# EAGLE design pcb_mlx90614 (EAGLE 9.6.2)
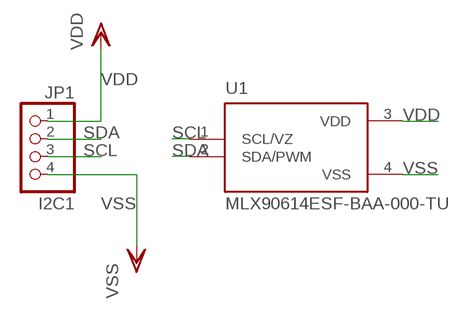
[diagram p0: schematic, sheet 1]

## Parts
JP1  I2C1  PINHD-1X4/90  [1X04/90]
U1  MLX90614ESF-BAA-000-TU  [TO254P942H425-4]

## Nets
SCL: JP1.3 U1.1(SCL/VZ)
SDA: JP1.2 U1.2(SDA/PWM)
VDD: JP1.1 U1.3(VDD)
VSS: JP1.4 U1.4(VSS)

## Library data of the parts
JP1 = pinhead:PINHD-1X4: PIN HEADER
U1 = MLX90614ESF-BAA-000-TU:MLX90614ESF-BAA-000-TU: Temperature Sensor Digital, Infrared (IR) -40°C ~ 85°C 16 b TO-39 Check availability <https://pricing.snapeda.com/parts/MLX90614ESF-BAA-000-TU/Melexis/view-part?ref=eda>; AVAILABILITY: In Stock; DESCRIPTION: Temperature Sensor Digital, Infrared (IR) -40°C ~ 85°C 16 b TO-39; MF: Melexis; MP: MLX90614ESF-BAA-000-TU; PACKAGE: TO-39 Melexis; PRICE: None; PURCHASE-URL: https://pricing.snapeda.com/search/part/MLX90614ESF-BAA-000-TU/?ref=eda

## Net classes
0 default: width 0.7 mm, drill 0.6 mm, clearance 0.3 mm

## Board
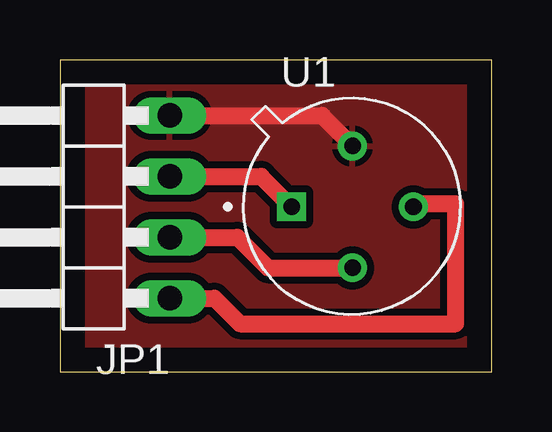
[diagram p1: board, top side]

Size 18 x 13 mm. Coordinates in mm from the lower left corner, seen from the top.
Outline: 0,0 18,0 18,13 0,13 0,0
Copper layers (1*16): Top 0.035mm / dielectric 1.5mm / Bottom 0.035mm
Design rules "default": minimum track width 6mil, minimum drill 0.35mm, track to track 6mil, track to pad 6mil, pad to pad 6mil, via to via 6mil, smd to smd 6mil, copper to edge 40mil, drill to drill 6mil, minimum pad ring 10mil, minimum via ring 8mil, stop-mask expansion 4mil, vias tented up to drill 0mil, thermal gap 10mil

### Footprints (pad centres in the part's own frame; a part is rotated, then mirrored left to right if it is on the bottom)
1X04/90 = drill 1.016 long: 1 -3.81,-3.81; 2 -1.27,-3.81; 3 1.27,-3.81; 4 3.81,-3.81
TO254P942H425-4 = drill 0.69 pad 1.09 square: 1 -2.54,0 | drill 0.69 pad 1.09: 2 0,-2.54; 3 2.54,0; 4 0,2.54

### Placement (x,y rotation side)
JP1  0.77,6.87 90 top
U1  12.2,6.87 0 top

### Tracks (layer width: path | path; a pad name or v marks a point on that pad's centre or on a via)
SCL
  Top 0.7: JP1.3 8.39,8.14 U1.1
SDA
  Top 0.7: JP1.2 7.4,5.6 8.67,4.33 U1.2
VDD
  Top 0.7: JP1.1 6.44,3.06 7.5,2 16.5,2 16.5,7 14.87,7 U1.3
VSS
  Top 0.7: JP1.4 10.93,10.68 U1.4
  pour Top: 0,13 18,13 18,0 0,0